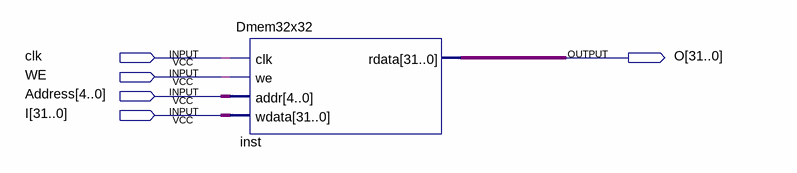
[diagram p0: schematic sheet]
// Quartus schematic DMEM(verilog).bdf as structural Verilog: 1 symbols, 5 pins
module \DMEM(verilog)  (
  input  clk,
  input  WE,
  input  [4:0] Address,
  input  [31:0] I,
  output [31:0] O
);

  Dmem32x32 inst (.clk(clk), .we(WE), .addr(Address), .wdata(I), .rdata(O));
endmodule
